# EAGLE schematic SharkBait_328 (EAGLE 7.1.0)
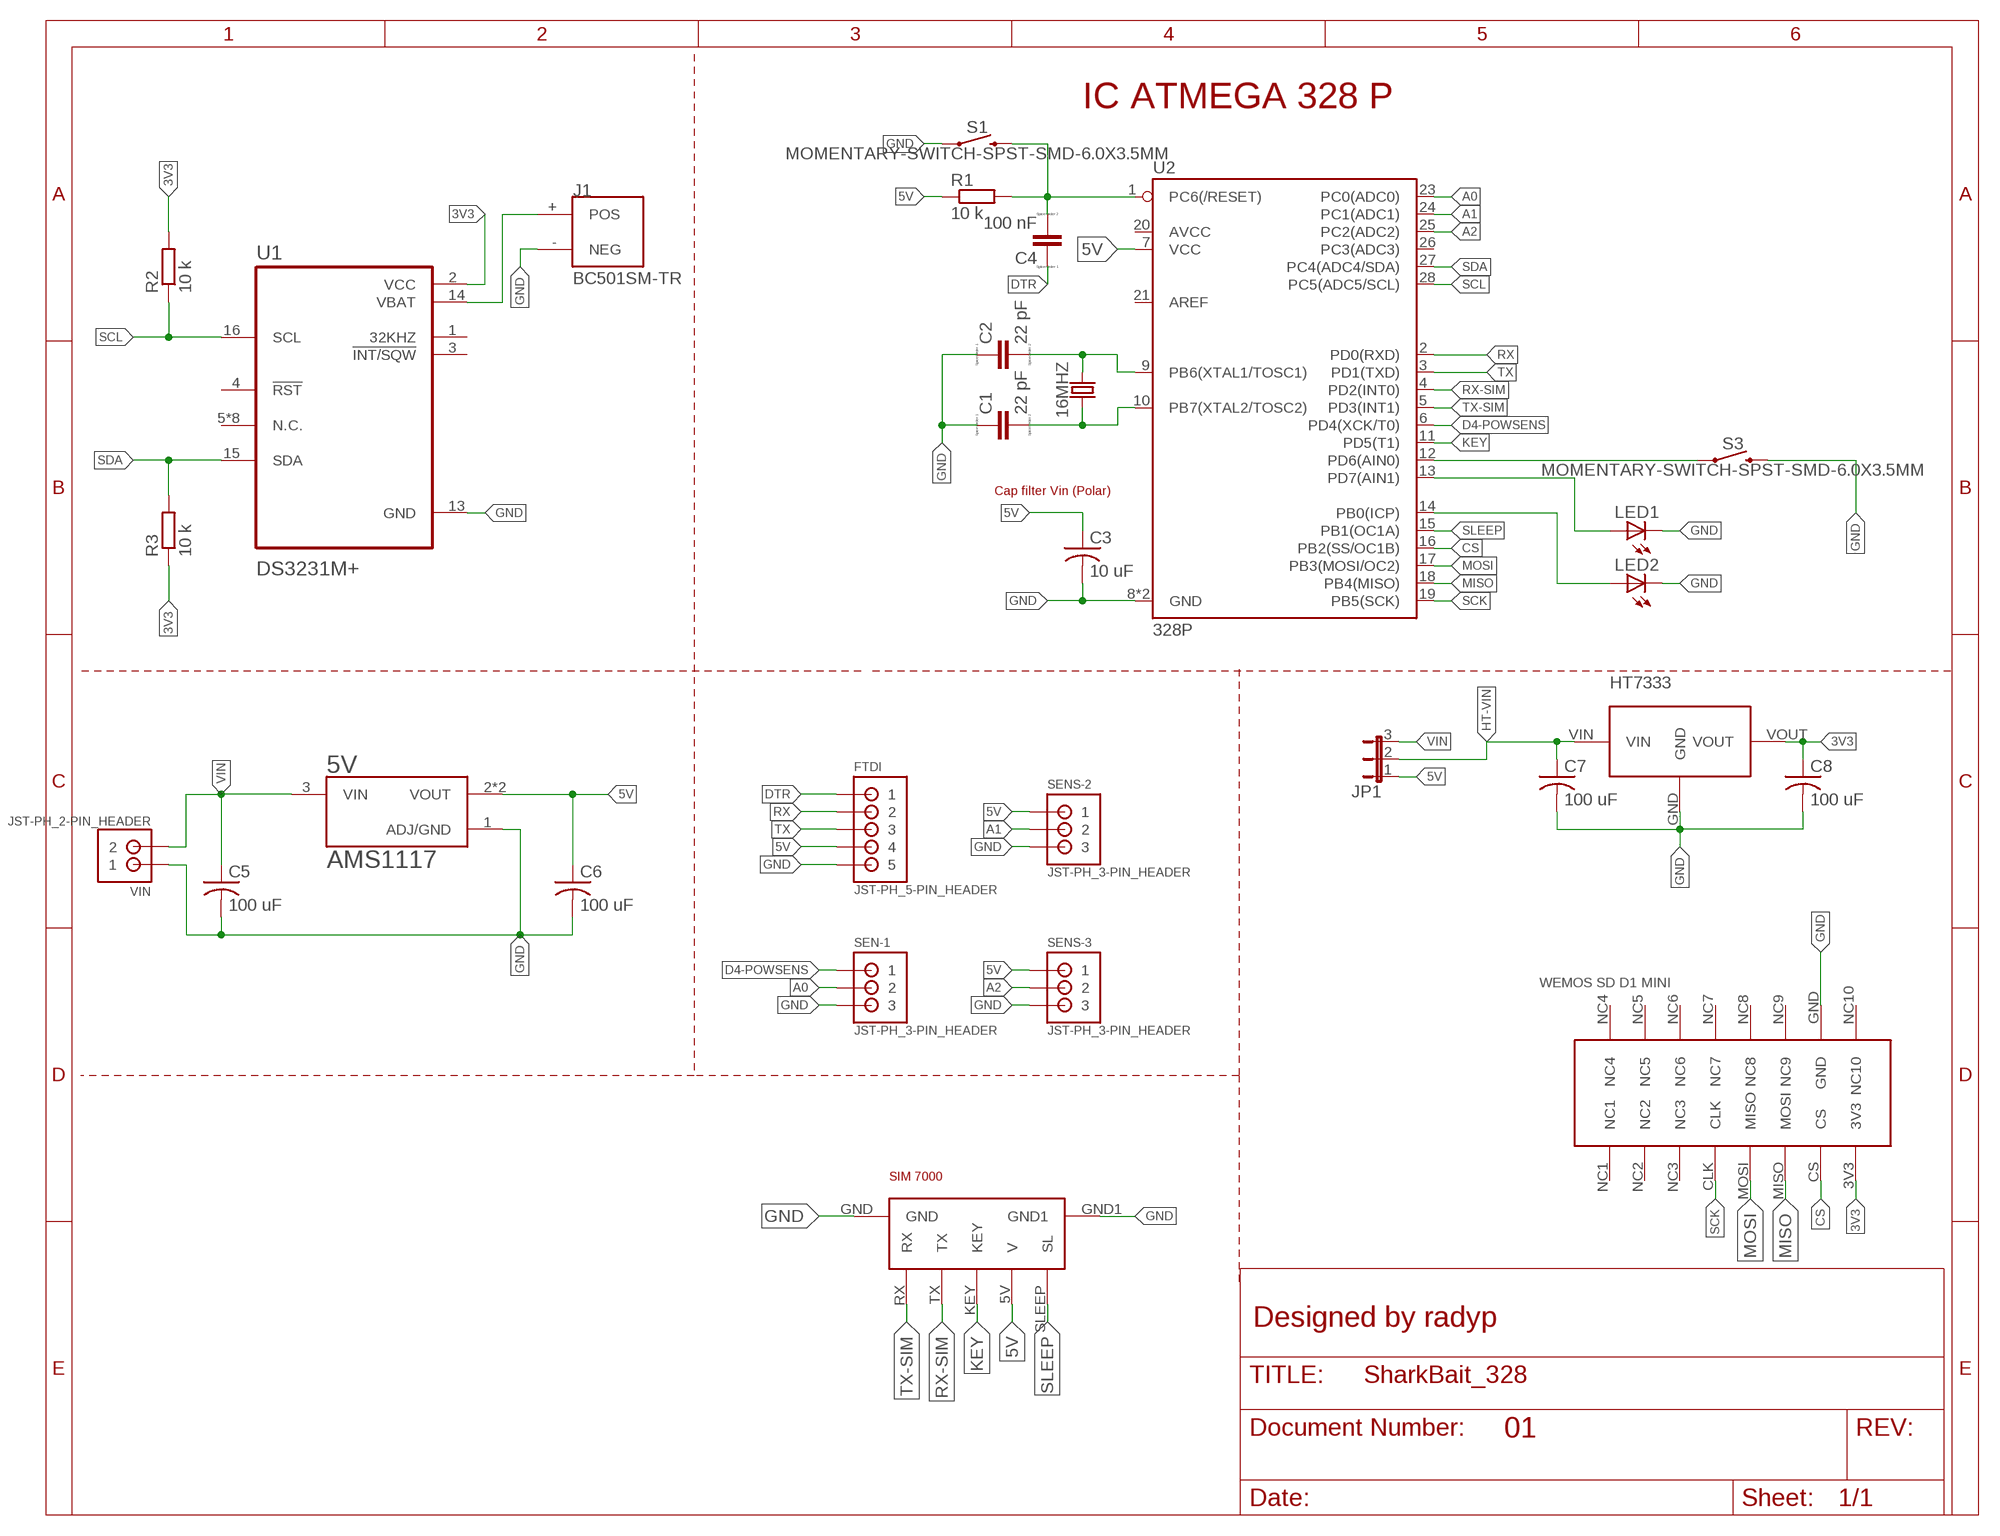
[diagram p0: schematic, sheet 1]

## Parts
5V  AMS1117  [SOT229P700X180-4N]
16MHZ  CRYSTALPTH-HC49US  [HC49US]
C1  22 pF  C  [C0805]
C2  22 pF  C  [C0805]
C3  10 uF  C-USC1206  [C1206]
C4  100 nF  C  [C0805]
C5  100 uF  C-USC1206  [C1206]
C6  100 uF  C-USC1206  [C1206]
C7  100 uF  C-USC1206  [C1206]
C8  100 uF  C-USC1206  [C1206]
FTDI  JST-PH_5-PIN_HEADER  [JST_B5B-PH_HEADER]
HT7333  HT7333  [SOT89]
J1  BC501SM-TR  [MPD_BC501SM-TR]
JP1  JP2E  [JP2]
LED1  LEDCHIP-LED0805  [CHIP-LED0805]
LED2  LEDCHIP-LED0805  [CHIP-LED0805]
R1  10 k  R-EU_M0805  [M0805]
R2  10 k  R-EU_M0805  [M0805]
R3  10 k  R-EU_M0805  [M0805]
S1  MOMENTARY-SWITCH-SPST-SMD-6.0X3.5MM  [TACTILE_SWITCH_SMD_6.0X3.5MM]
S3  MOMENTARY-SWITCH-SPST-SMD-6.0X3.5MM  [TACTILE_SWITCH_SMD_6.0X3.5MM]
SEN-1  JST-PH_3-PIN_HEADER  [JST_B3B-PH_HEADER]
SENS-2  JST-PH_3-PIN_HEADER  [JST_B3B-PH_HEADER]
SENS-3  JST-PH_3-PIN_HEADER  [JST_B3B-PH_HEADER]
U1  DS3231M+  [SOIC127P1032X265-16N]
U2  328P  ATMEGA328P_PDIP  [DIP28]
U$1  WEMOS_SD_D1_MINI  [WEMOS_SD_D1_MINI]
U$2  SIM7000  [SIM_7000]
VIN  JST-PH_2-PIN_HEADER  [JST_B2B-PH_HEADER]

## Nets
3V3: C8.1 HT7333.VOUT R2.2 R3.1 U1.2(VCC) U$1.3V3
5V: 5V.2(VOUT) 5V.4(VOUT) C3.1 C6.1 FTDI.P4 JP1.1 R1.1 SENS-2.P1 SENS-3.P1 U2.7(VCC) U$2.5V(V)
A0: SEN-1.P2 U2.23(PC0(ADC0))
A1: SENS-2.P2 U2.24(PC1(ADC1))
A2: SENS-3.P2 U2.25(PC2(ADC2))
CS: U2.16(PB2(SS/OC1B)) U$1.CS
D4-POWSENS: SEN-1.P1 U2.6(PD4(XCK/T0))
DTR: C4.1 FTDI.P1
GND: 5V.1(ADJ/GND) C1.1 C2.1 C3.2 C5.2 C6.2 C7.2 C8.2 FTDI.P5 HT7333.GND J1.-(NEG) LED1.C LED2.C S1.1 S3.2 SEN-1.P3 SENS-2.P3 SENS-3.P3 U1.13(GND) U2.8(GND) U2.22(GND) U$1.GND U$2.GND U$2.GND1 VIN.P1
HT-VIN: C7.1 HT7333.VIN JP1.2
KEY: U2.11(PD5(T1)) U$2.KEY
MISO: U2.18(PB4(MISO)) U$1.MISO(MOSI)
MOSI: U2.17(PB3(MOSI/OC2)) U$1.MOSI(MISO)
N$1: 16MHZ.2 C2.2 U2.9(PB6(XTAL1/TOSC1))
N$2: 16MHZ.1 C1.2 U2.10(PB7(XTAL2/TOSC2))
N$4: J1.+(POS) U1.14(VBAT)
N$5: LED1.A U2.13(PD7(AIN1))
N$7: S3.1 U2.12(PD6(AIN0))
N$8: LED2.A U2.14(PB0(ICP))
N$10: C4.2 R1.2 S1.2 U2.1(PC6(/RESET))
RX: FTDI.P2 U2.2(PD0(RXD))
RX-SIM: U2.4(PD2(INT0)) U$2.TX
SCK: U2.19(PB5(SCK)) U$1.CLK
SCL: R2.1 U1.16(SCL) U2.28(PC5(ADC5/SCL))
SDA: R3.2 U1.15(SDA) U2.27(PC4(ADC4/SDA))
SLEEP: U2.15(PB1(OC1A)) U$2.SLEEP(SL)
TX: FTDI.P3 U2.3(PD1(TXD))
TX-SIM: U2.5(PD3(INT1)) U$2.RX
VIN: 5V.3(VIN) C5.1 JP1.3 VIN.P2
Unconnected: U1.1(32KHZ) U1.3(!INT/SQW) U1.4(!RST) U1.5(N.C.) U1.6(N.C.) U1.7(N.C.) U1.8(N.C.) U1.9(N.C.) U1.10(N.C.) U1.11(N.C.) U1.12(N.C.) U2.20(AVCC) U2.21(AREF) U2.26(PC3(ADC3)) U$1.NC1 U$1.NC2 U$1.NC3 U$1.NC4 U$1.NC5 U$1.NC6 U$1.NC7 U$1.NC8 U$1.NC9 U$1.NC10

## Notes on the sheet
- IC ATMEGA 328 P
- Cap filter Vin (Polar)
- Designed by radyp
- 01

## Library data of the parts
5V = C_AMS1117:AMS1117: Sot223/Pkg 1-Amp 5-Volt Low Drop Out Voltage Regulatator; AVAILABILITY: Unavailable; DESCRIPTION: 1A LOW DROPOUT VOLTAGE REGULATOR; MF: Seeed Technology; MP: AMS1117; PACKAGE: SOT-223 Seeed Technology; PRICE: None
16MHZ = SparkFun-Clocks:CRYSTAL: Crystals (Generic) These are passive quartz crystals, which can be used as a clock source for a microcontroller. Crystal's are two-terminal devices. They require external "load" capacitors to generate an oscillating signal.
C1 C2 C4 = eagle-ltspice:C: CAPACITOR, European symbol; SPICEMODEL: NONE; SPICEPREFIX: C
C3 C5-C8 = adafruit:C-US: CAPACITOR, American symbol
FTDI = srg:JST-PH_5-PIN_HEADER: 5-pin JST PH Shrouded Header, top entry P/N B5B-PH-K-S Mating connector PHR-5 Mating cable assembly: Sparkfun PRT-09917 <http://www.sparkfun.com/products/9917>
HT7333 = C_HT7333_SOT89:HT7333
J1 = C_BC501SM-TR:BC501SM-TR: Holder Coin Cell For Cr1220 Smd; AVAILABILITY: Unavailable; DESCRIPTION: Holder Coin Cell For Cr1220 Smd; MF: MPD _Memory; MP: BC501SM-TR; PACKAGE: DFN-8 MPD; PRICE: None
JP1 = jumper:JP2E: JUMPER
LED1 LED2 = adafruit:LED: LED OSRAM: - CHIPLED LG R971, LG N971, LY N971, LG Q971, LY Q971, LO R971, LY R971 LH N974, LH R974 LS Q976, LO Q976, LY Q976 LO Q996 - Hyper CHIPLED LW Q18S LB Q993, LB Q99A, LB R99A - SideLED LS A670, LO A670, LY A670, LG A670, LP A670 LB A673, LV A673, LT A673, LW A673 LH A674 LY A675 LS A676, LA A676, LO A676, LY A676, LW A676 LS A679, LY A679, LG A679 - Hyper Micro SIDELED® LS Y876, LA Y876, LO Y876, LY Y876 LT Y87S - SmartLED LW L88C, LW L88S LB L89C, LB L89S, LG L890 LS L89K, LO L89K, LY L89K LS L896, LA L896, LO L896, LY L896 - TOPLED LS T670, LO T670, LY T670, LG T670, LP T670 LSG T670, LSP T670, LSY T670, LOP T670, LYG T670 LG T671, LOG T671, LSG T671 LB T673, LV T673, LT T673, LW T673 LH T674 LS T676, LA T676, LO T676, LY T676, LB T676, LH T676, LSB T676, LW T676 LB T67C, LV T67C, LT T67C, LS T67K, LO T67K, LY T67K, LW E67C LS E67B, LA E67B, LO E67B, LY E67B, LB E67C, LV E67C, LT E67C LW T67C LS T679, LY T679, LG T679 LS T770, LO T770, LY T770, LG T770, LP T770 LB T773, LV T773, LT T773, LW T773 LH T774 LS E675, LA E675, LY E675, LS T675 LS T776, LA T776, LO T776, LY T776, LB T776 LHGB T686 LT T68C, LB T68C - Hyper Mini TOPLED® LB M676 - Mini TOPLED Santana® LG M470 LS M47K, LO M47K, LY M47K Source: http://www.osram.convergy.de/
R1-R3 = resistor:R-EU_: RESISTOR, European symbol
S1 S3 = SparkFun-Switches:MOMENTARY-SWITCH-SPST: Momentary Switch (Pushbutton) - SPST Normally-open (NO) SPST momentary switches (buttons, pushbuttons). Variants PTH-12MM - 12mm square, through-hole Momentary Pushbutton Switch - 12mm Square <https://www.sparkfun.com/products/9190> (COM-09190) PTH-6.0MM, PTH-6.0MM-KIT - 6.0mm square, through-hole Mini Pushbutton Switch <https://www.sparkfun.com/products/97> (COM-00097) KIT package intended for soldering kit's - only one side of pads' copper is exposed. PTH-RIGHT-ANGLE-KIT - Right-angle, through-hole Right Angle Tactile Button <https://www.sparkfun.com/products/10791> - Used on SparkFun BigTime Watch Kit <https://www.sparkfun.com/products/11734> SMD-12MM - 12mm square, surface-mount Tactile Button - SMD (12mm) <https://www.sparkfun.com/products/12993> (COM-12993) Used on SparkFun PicoBoard <https://www.sparkfun.com/products/11888> SMD-4.5MM - 4.5mm Square Trackball Switch Used on SparkFun Blackberry Trackballer Breakout <https://www.sparkfun.com/products/13169> SMD-4.6MMX2.8MM - 4.60mm x 2.80mm, surface mount Used on SparkFun SAMD21 Mini Breakout <https://www.sparkfun.com/products/13664> SMD-5.2MM, SMD-5.2-REDUNDANT - 5.2mm square, surface-mount Mini Pushbutton Switch - SMD <https://www.sparkfun.com/products/8720> (COM-08720) Used on Arduino Pro Mini <https://www.sparkfun.com/products/11114> REDUNDANT package connects both switch circuits together SMD-6.0X3.5MM - 6.0 x 3.5mm, surface mount Momentary Reset Switch SMD <https://www.sparkfun.com/products/8229> (COM-08229) SMD-6.2MM-TALL - 6.2mm square, surface mount Tactile Button - SMD (6mm) <https://www.sparkfun.com/products/12992> Used on SparkFun Digital Sandbox <https://www.sparkfun.com/products/12651> SMD-RIGHT-ANGLE - Right-angle, surface mount Used on SparkFun Block for Intel® Edison - Arduino <https://www.sparkfun.com/products/13036>; PROD_ID: SWCH-00815; SF_SKU: COM-08229
SEN-1 SENS-2 SENS-3 = srg:JST-PH_3-PIN_HEADER: 3-pin JST PH Shrouded Header, top entry P/N B3B-PH-K-S Mating connector PHR-3
U1 = C_DS3231M_:DS3231M+; DESCRIPTION: Ic Real Time Clock I2c 16soic - Ds3231m+; DIGI-KEY_PART_NUMBER: DS3231M+-ND; DIGI-KEY_PURCHASE_URL: https://www.digikey.co.id/product-detail/en/maxim-integrated/DS3231M-/DS3231M--ND/2402420?utm_source=snapeda&utm_medium=aggregator&utm_campaign=symbol; MF: Maxim Integrated; MP: DS3231M+; PACKAGE: SOIC-16 Maxim
U2 = SparkFun-IC-Microcontroller:ATMEGA328P_PDIP: Atmel 328P Through hole ATMEGA328P uC used in the Arduino 32kb flash, 1k EEPROM, 2k SRAM Datasheet <http://www.sparkfun.com/datasheets/Components/SMD/ATMega328.pdf> SparkFun Products Storefront component: AVR 28 Pin 20MHz 32K 6A/D - ATMega328P <https://www.sparkfun.com/products/9061> (COM-09061) SparkFun Simon Says - Through-Hole Soldering Kit <https://www.sparkfun.com/products/10547> (KIT-10547) SparkFun Learn to Solder - Simon Says <https://www.sparkfun.com/products/13708> (KIT-13708) SparkFun BigTime Watch Kit <https://www.sparkfun.com/products/11734> (KIT-11734) SparkFun ClockIt <https://www.sparkfun.com/products/10930> (KIT-10930) SparkFun Serial Enabled LCD Kit <https://www.sparkfun.com/products/10097> (LCD-10097) SparkFun Simon Tilts - Through Hole Soldering Kit <https://www.sparkfun.com/products/12634> (KIT-12634) SparkFun Frequency Counter Kit <https://www.sparkfun.com/products/10140> (KIT-10140) FabFM Radio Kit <https://www.sparkfun.com/products/11043> (KIT-11043) SparkFun Binary Blaster Kit <https://www.sparkfun.com/products/12037> (KIT-12037) SparkFun Metro-Gnome <https://www.sparkfun.com/products/9236> (KIT-09236) ATmega328 with Arduino Optiboot (Uno) <https://www.sparkfun.com/products/10524> (DEV-10524); PROD_ID: IC-09136
U$1 = C_WEMOS_SD_D1_MINI:WEMOS_SD_D1_MINI
U$2 = C_SIM7000:SIM7000
VIN = srg:JST-PH_2-PIN_HEADER: 2-pin JST PH Shrouded Header, top entry P/N B2B-PH-K-S Mating connector PHR-2 Mating cable assembly: Sparkfun PRT-09914 <http://www.sparkfun.com/products/9914>